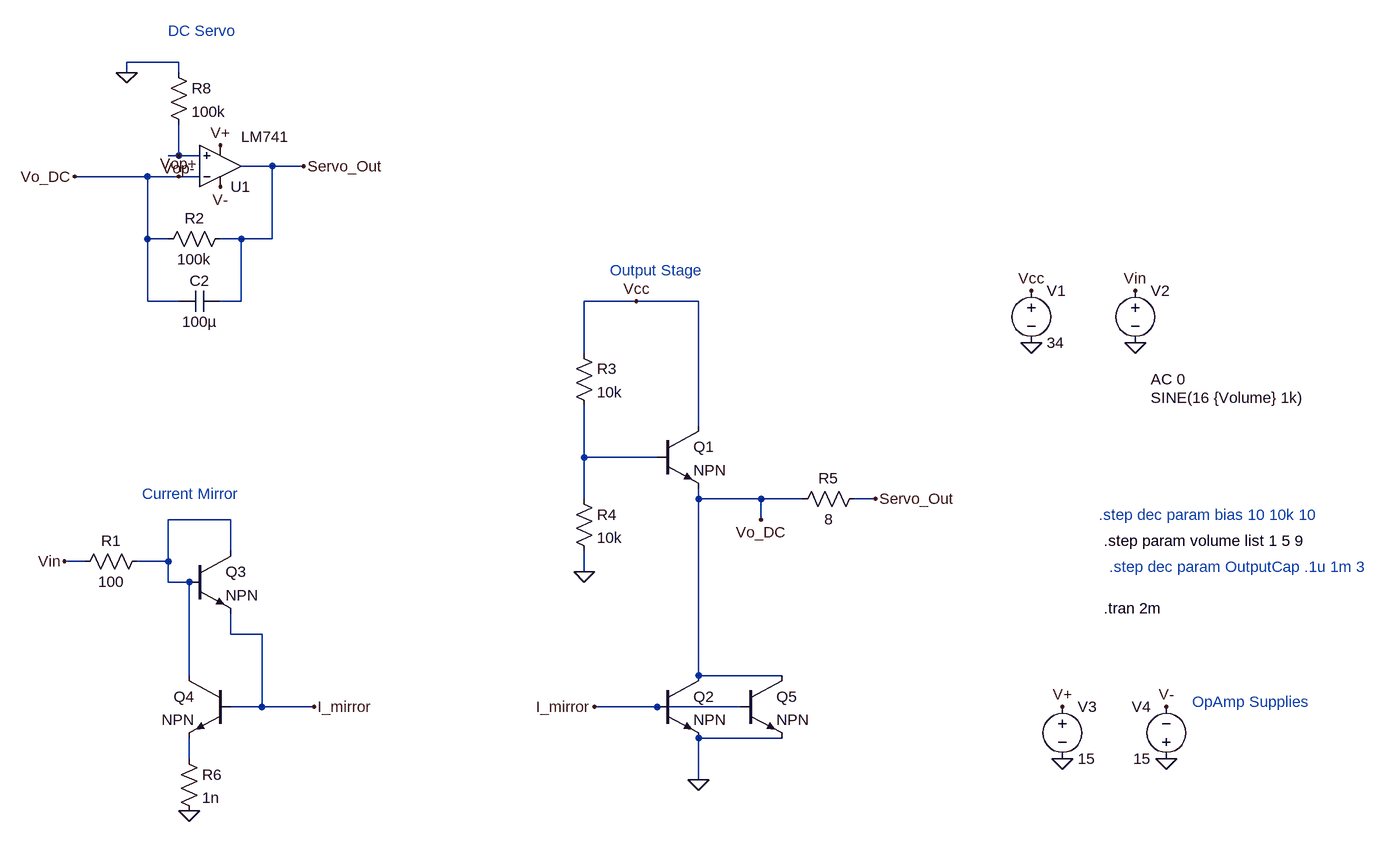
[diagram p0: schematic Dynamic_Bias_withServo.asc]
Dynamic_Bias_withServo.asc, the LTspice schematic file:
Version 4
SHEET 1 880 680
WIRE -1952 -800 -2032 -800
WIRE -2032 -784 -2032 -800
WIRE -1952 -784 -1952 -800
WIRE -1952 -656 -1952 -704
WIRE -1952 -656 -1968 -656
WIRE -1920 -656 -1952 -656
WIRE -1808 -640 -1856 -640
WIRE -1760 -640 -1808 -640
WIRE -2000 -624 -2112 -624
WIRE -1952 -624 -2000 -624
WIRE -1920 -624 -1952 -624
WIRE -2000 -528 -2000 -624
WIRE -1968 -528 -2000 -528
WIRE -1856 -528 -1888 -528
WIRE -1808 -528 -1808 -640
WIRE -1808 -528 -1856 -528
WIRE -2000 -432 -2000 -528
WIRE -1952 -432 -2000 -432
WIRE -1856 -432 -1856 -528
WIRE -1856 -432 -1888 -432
WIRE -1248 -432 -1328 -432
WIRE -1152 -432 -1248 -432
WIRE -1328 -352 -1328 -432
WIRE -1152 -240 -1152 -432
WIRE -1328 -192 -1328 -272
WIRE -1216 -192 -1328 -192
WIRE -1328 -128 -1328 -192
WIRE -1152 -128 -1152 -144
WIRE -1056 -128 -1152 -128
WIRE -992 -128 -1056 -128
WIRE -880 -128 -912 -128
WIRE -1872 -96 -1968 -96
WIRE -1056 -96 -1056 -128
WIRE -1872 -48 -1872 -96
WIRE -2096 -32 -2128 -32
WIRE -1968 -32 -1968 -96
WIRE -1968 -32 -2016 -32
WIRE -1328 -16 -1328 -48
WIRE -1968 0 -1968 -32
WIRE -1936 0 -1968 0
WIRE -1872 80 -1872 48
WIRE -1824 80 -1872 80
WIRE -1936 144 -1936 0
WIRE -1152 144 -1152 -128
WIRE -1024 144 -1152 144
WIRE -1824 192 -1824 80
WIRE -1824 192 -1872 192
WIRE -1744 192 -1824 192
WIRE -1216 192 -1312 192
WIRE -1088 192 -1216 192
WIRE -1024 240 -1152 240
WIRE -1936 272 -1936 240
WIRE -1152 304 -1152 240
FLAG -640 -448 Vcc
FLAG -640 -368 0
FLAG -480 -368 0
FLAG -480 -448 Vin
FLAG -432 272 0
FLAG -592 272 0
FLAG -592 192 V+
FLAG -432 192 V-
FLAG -1248 -432 Vcc
FLAG -2128 -32 Vin
FLAG -1888 -672 V+
FLAG -1888 -608 V-
FLAG -1760 -640 Servo_Out
FLAG -1952 -624 Vop+
FLAG -1952 -656 Vop-
FLAG -2112 -624 Vo_DC
FLAG -2032 -784 0
FLAG -1152 304 0
FLAG -1936 352 0
FLAG -1744 192 I_mirror
FLAG -1312 192 I_mirror
FLAG -1328 -16 0
FLAG -880 -128 Servo_Out
FLAG -1056 -96 Vo_DC
SYMBOL voltage -640 -464 R0
WINDOW 123 0 0 Left 2
WINDOW 39 0 0 Left 2
SYMATTR InstName V1
SYMATTR Value 34
SYMBOL voltage -480 -464 R0
WINDOW 3 24 180 Left 2
WINDOW 123 24 152 Left 2
WINDOW 39 24 124 Left 2
SYMATTR Value SINE(16 {Volume} 1k)
SYMATTR Value2 AC 0
SYMATTR InstName V2
SYMBOL voltage -592 176 R0
WINDOW 123 0 0 Left 2
WINDOW 39 0 0 Left 2
SYMATTR InstName V3
SYMATTR Value 15
SYMBOL voltage -432 288 R180
WINDOW 0 24 96 Left 2
WINDOW 3 24 16 Left 2
WINDOW 123 0 0 Left 2
WINDOW 39 0 0 Left 2
SYMATTR InstName V4
SYMATTR Value 15
SYMBOL npn -1216 -240 R0
SYMATTR InstName Q1
SYMBOL Opamps\\LM741 -1888 -576 M180
WINDOW 3 32 109 Left 2
SYMATTR InstName U1
SYMBOL res -1984 -512 R270
WINDOW 0 32 56 VTop 2
WINDOW 3 0 56 VBottom 2
SYMATTR InstName R2
SYMATTR Value 100k
SYMBOL cap -1952 -416 R270
WINDOW 0 32 32 VTop 2
WINDOW 3 0 32 VBottom 2
SYMATTR InstName C2
SYMATTR Value 100µ
SYMBOL res -1968 -800 R0
SYMATTR InstName R8
SYMATTR Value 100k
SYMBOL npn -1216 144 R0
SYMATTR InstName Q2
SYMBOL npn -1936 -48 R0
SYMATTR InstName Q3
SYMBOL npn -1872 144 M0
SYMATTR InstName Q4
SYMBOL res -2112 -16 R270
WINDOW 0 32 56 VTop 2
WINDOW 3 0 56 VBottom 2
SYMATTR InstName R1
SYMATTR Value 100
SYMBOL npn -1088 144 R0
SYMATTR InstName Q5
SYMBOL res -1344 -368 R0
SYMATTR InstName R3
SYMATTR Value 10k
SYMBOL res -1344 -144 R0
SYMATTR InstName R4
SYMATTR Value 10k
SYMBOL res -1952 256 R0
SYMATTR InstName R6
SYMATTR Value 1n
SYMBOL res -1008 -112 R270
WINDOW 0 32 56 VTop 2
WINDOW 3 0 56 VBottom 2
SYMATTR InstName R5
SYMATTR Value 8
TEXT -528 40 Left 2 !.tran 2m
TEXT -536 -104 Left 2 ;.step dec param bias 10 10k 10
TEXT -528 -64 Left 2 !.step param volume list 1 5 9
TEXT -520 -24 Left 2 ;.step dec param OutputCap .1u 1m 3
TEXT -392 184 Left 2 ;OpAmp Supplies
TEXT -1968 -848 Left 2 ;DC Servo
TEXT -1288 -480 Left 2 ;Output Stage
TEXT -2008 -136 Left 2 ;Current Mirror

The netlist it stands for:
* Dynamic_Bias_withServo.asc
V1 Vcc 0 34
V2 Vin 0 SINE(16 {Volume} 1k) AC 0
V3 V+ 0 15
V4 0 V- 15
Q1 Vcc N001 Vo_DC 0 NPN
XU1 Vop- Vo_DC V- V+ Servo_Out LM741  ; pins In+ In- V+ V- OUT
R2 Vo_DC Servo_Out 100k
C2 Vo_DC Servo_Out 100µ
R8 0 Vop- 100k
Q2 Vo_DC I_mirror 0 0 NPN
Q3 N002 N002 I_mirror 0 NPN
Q4 N002 I_mirror N003 0 NPN
R1 Vin N002 100
Q5 Vo_DC I_mirror 0 0 NPN
R3 Vcc N001 10k
R4 N001 0 10k
R6 N003 0 1n
R5 Vo_DC Servo_Out 8
.model NPN NPN
.model PNP PNP
.lib standard.bjt
.tran 2m
* .step dec param bias 10 10k 10
.step param volume list 1 5 9
* .step dec param OutputCap .1u 1m 3
* OpAmp Supplies
* DC Servo
* Output Stage
* Current Mirror
.lib LM741.lib
.backanno
.end